# Altium project SAMW25_Xplained_Pro.PrjPCB (part 2 of 2)

## Sheet SAMW25_Xplained_Pro_triple_input_power_supply.SchDoc: Power supply
size A3; Organization: ATMEL Norway; Address1: Vestre Rosten 79; Address2: N-7075 TILLER; Address3: NORWAY; DocumentNumber: A09-2449; Revision: 1; SheetNumber: 2; SheetTotal: 5; PageSetup: Record=PageOptions|CenterHorizontal=True|CenterVertical=True|PrintScale=1.01|XCorrection=1.00|YCorrection=1.00|PrintKind=1|BorderSize=5000000|LeftOffset=0|BottomOffset=0|Orientation=2|PaperLength=1000|PaperWidth=1000|Scale=100|PaperSource=7|PrintQuality=-4|MediaType=1|DitherType=10|PaperKind=A3 (297 x 420 mm)|PrintScaleMode=1
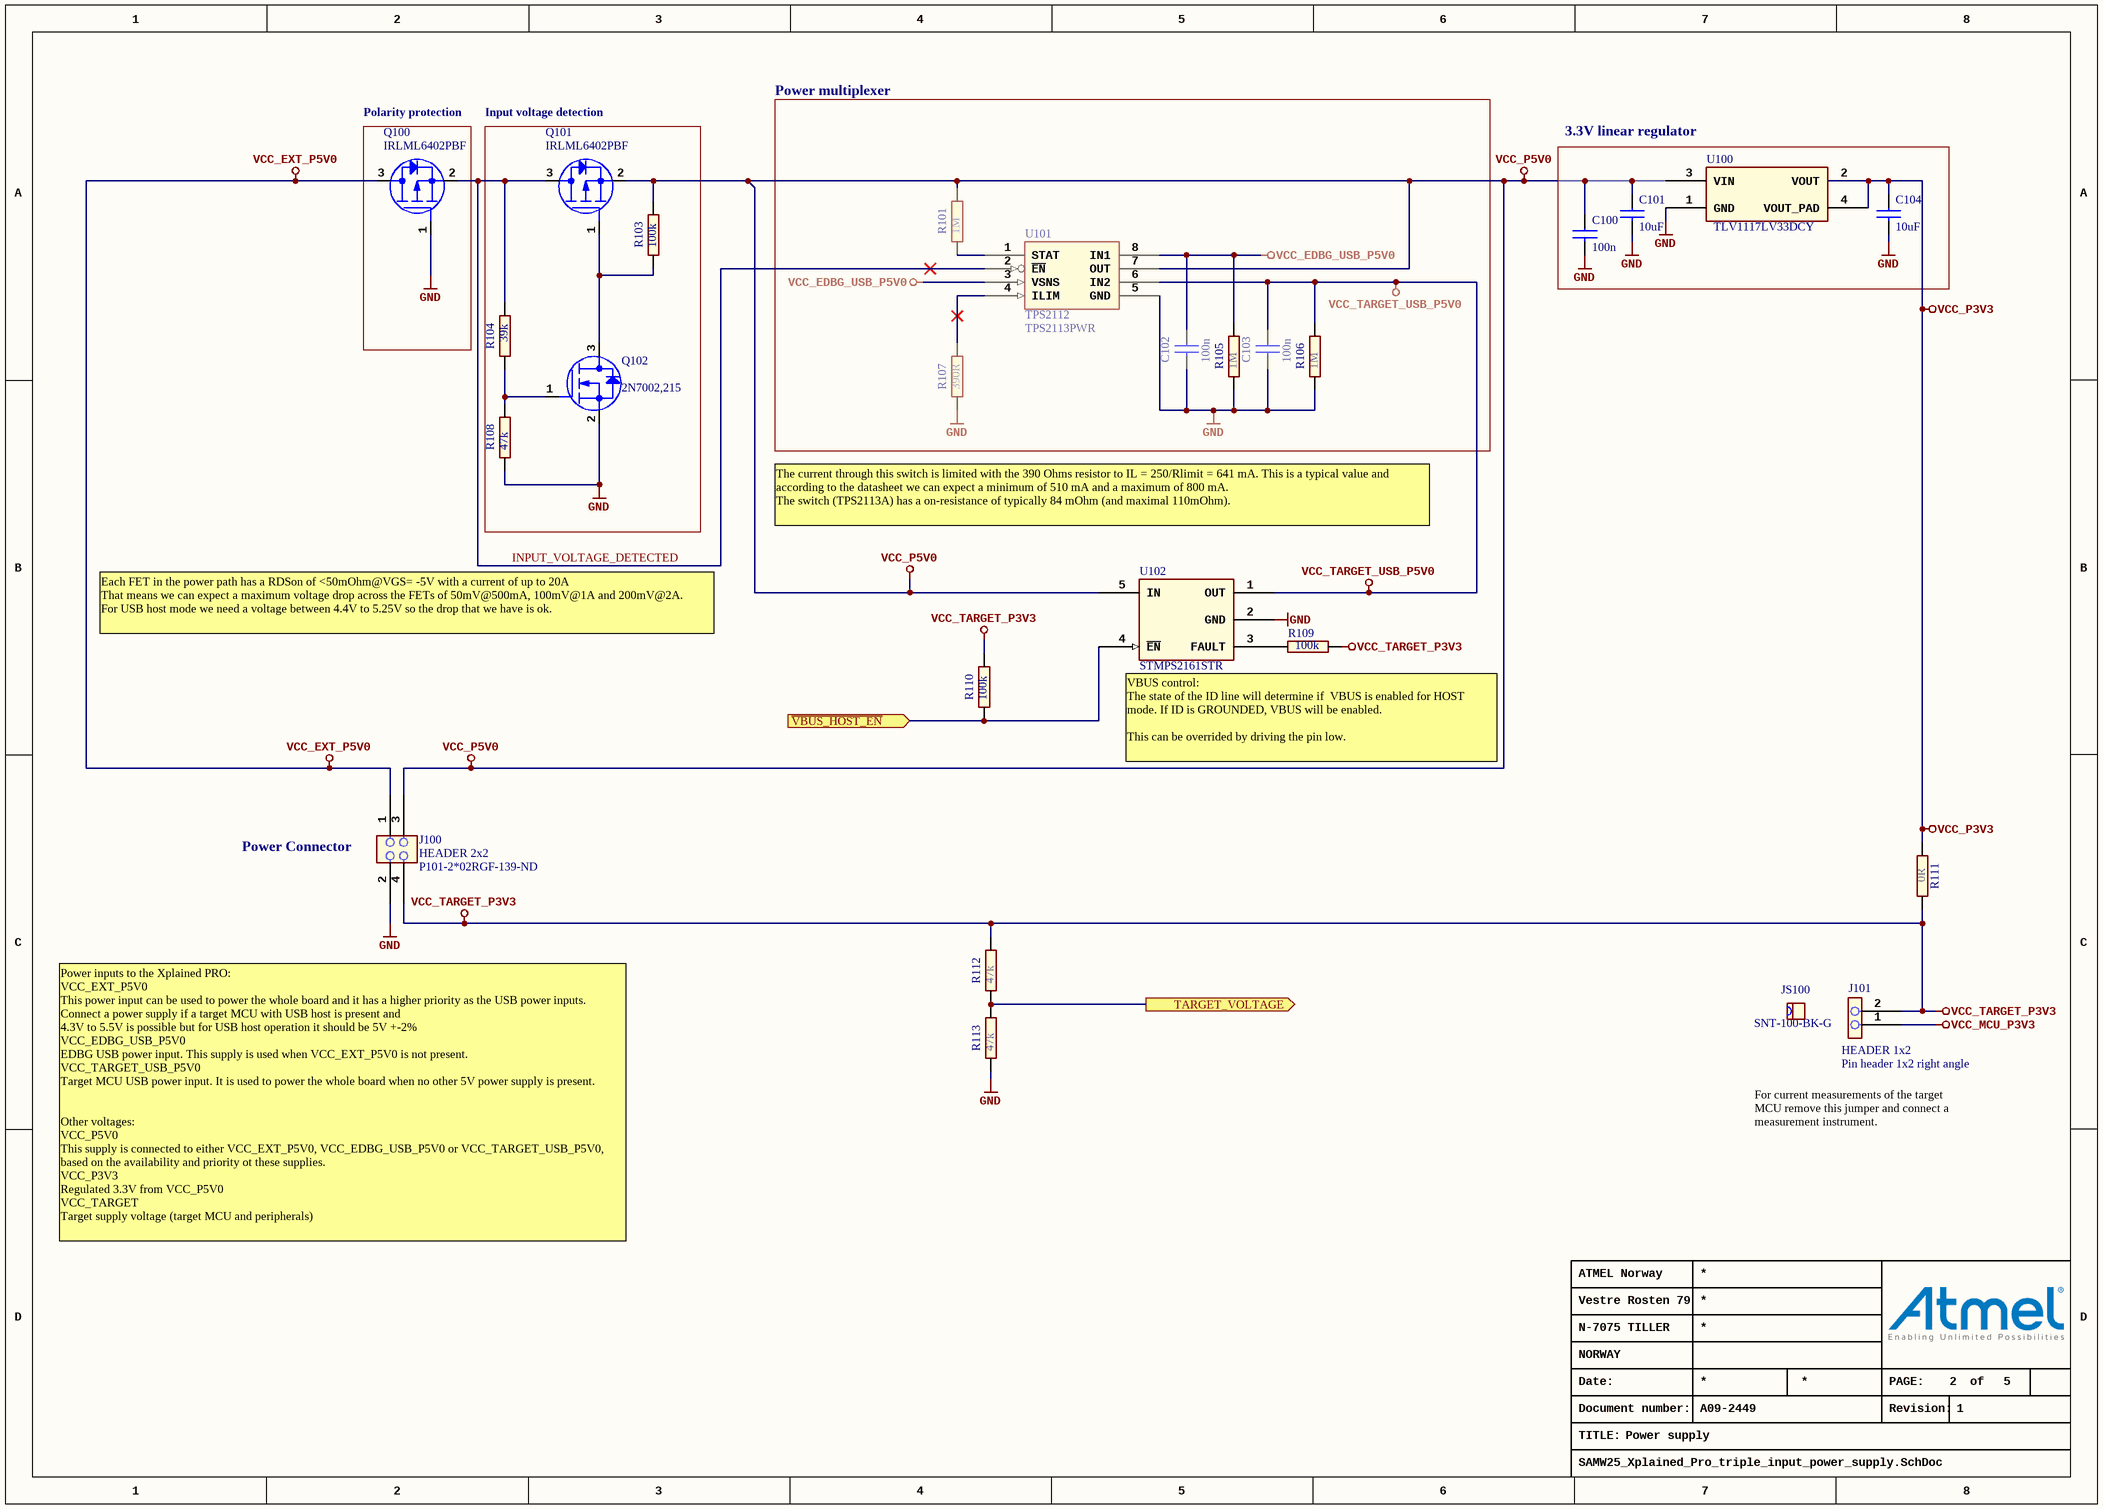
[diagram p4: SAMW25_Xplained_Pro_triple_input_power_supply.SchDoc]

### Parts
C100  value 100n  [AP1-00001]  (hidden comment: CAP-NONPOL)
C101  value 10uF  [AP1-00039]  (hidden comment: CAP-NONPOL)
C102  value 100n  [AP1-00053]  (hidden comment: CAP-NONPOL)
C103  value 100n  [AP1-00053]  (hidden comment: CAP-NONPOL)
C104  value 10uF  [AP1-00039]  (hidden comment: CAP-NONPOL)
J100  HEADER 2x2  value P101-2*02RGF-139-ND  [AP8-00628]
J101  HEADER 1x2  value Pin header 1x2 right angle  [AP8-00367]
JS100  value SNT-100-BK-G  [AP8-00525]  (hidden comment: To be used by request from ESCATEC)
Q100  value IRLML6402PBF  [AP5-00002]  (hidden comment: MOSFET_P_GSD)
Q101  value IRLML6402PBF  [AP5-00002]  (hidden comment: MOSFET_P_GSD)
Q102  value 2N7002,215  [AP5-00002]  (hidden comment: MOSFET_N_GSD)
R101  value 1M  [AP2-00011]  (hidden comment: R2)
R103  value 100k  [AP2-00011]  (hidden comment: R2)
R104  value 39k  [AP2-00011]  (hidden comment: R2)
R105  value 1M  [AP2-00011]  (hidden comment: R2)
R106  value 1M  [AP2-00011]  (hidden comment: R2)
R107  value 390R  [AP2-00011]  (hidden comment: R2)
R108  value 47k  [AP2-00011]  (hidden comment: R2)
R109  value 100k  [AP2-00011]  (hidden comment: R2)
R110  value 100k  [AP2-00011]  (hidden comment: R2)
R111  value 0R  [AP2-00011]  (hidden comment: R2)
R112  value 47k  [AP2-00011]  (hidden comment: R2)
R113  value 47k  [AP2-00011]  (hidden comment: R2)
U100  value TLV1117LV33DCY  [AP6-00399]  (hidden comment: VOLTREG_SOT223_4)
U101  TPS2112  value TPS2113PWR  [AP6-00054]
U102  value STMPS2161STR  [AP6-00087]  (hidden comment: STMPS2161)

### Blocks framed on the sheet
Polarity protection: Q100
Input voltage detection: Q101 Q102 R103 R104 R108
Power multiplexer: C102 C103 R101 R105-R107 U101
3.3V linear regulator: C100 C101 C104 U100

### Ports
TARGET_VOLTAGE (out), ~{VBUS_HOST_EN} (in)

### Nets
GND: C100.2 C101.2 C102.2 C103.2 C104.2 J100.2 Q100.1(G) Q102.2(S) R105.1 R106.1 R107.1 R108.1 R113.1 U100.1(GND) U101.5(GND) U102.2(GND)
VCC_EDBG_USB_P5V0: C102.1 R105.2 U101.3(VSNS) U101.8(IN1)
VCC_EXT_P5V0: J100.1 Q100.3(D)
VCC_MCU_P3V3: J101.1
VCC_P3V3: C104.1 R111.1 U100.2(VOUT) U100.4(VOUT_PAD)
VCC_P5V0: C100.1 C101.1 J100.3 Q101.2(S) R101.2 R103.2 U100.3(VIN) U101.7(OUT) U102.5(IN)
VCC_TARGET_P3V3: J100.4 J101.2 R109.1 R110.2 R111.2 R112.2
VCC_TARGET_USB_P5V0: C103.1 R106.2 U101.6(IN2) U102.1(OUT)
EDBG_ADC0: R112.1 R113.2 ; port TARGET_VOLTAGE
INPUT_VOLTAGE_DETECTED: Q100.2(S) Q101.3(D) R104.2 U101.2(~{EN})
TARGET_USB_ID: R110.1 U102.4(~{EN}) ; port ~{VBUS_HOST_EN}
NetQ101_1: Q101.1(G) Q102.3(D) R103.1
NetQ102_1: Q102.1(G) R104.1 R108.2
NetR101_1: R101.1 U101.1(STAT)
NetR107_2: R107.2 U101.4(ILIM)
NetR109_2: R109.2 U102.3(FAULT)

### Notes on the sheet
- The current through this switch is limited with the 390 Ohms resistor to IL = 250/Rlimit = 641 mA. This is a typical value and according to the datasheet we can expect a minimum of 510 mA and a maximum of 800 mA.
  The switch (TPS2113A) has a on-resistance of typically 84 mOhm (and maximal 110mOhm).
- Each FET in the power path has a RDSon of <50mOhm@VGS= -5V with a current of up to 20A
  That means we can expect a maximum voltage drop across the FETs of 50mV@500mA, 100mV@1A and 200mV@2A.
  For USB host mode we need a voltage between 4.4V to 5.25V so the drop that we have is ok.
- VBUS control:
  The state of the ID line will determine if  VBUS is enabled for HOST mode. If ID is GROUNDED, VBUS will be enabled.
  This can be overrided by driving the pin low.
- (near J100) Power Connector
- For current measurements of the target MCU remove this jumper and connect a measurement instrument.
- Power inputs to the Xplained PRO:
  VCC_EXT_P5V0
  This power input can be used to power the whole board and it has a higher priority as the USB power inputs. Connect a power supply if a target MCU with USB host is present and
  4.3V to 5.5V is possible but for USB host operation it should be 5V +-2%
  VCC_EDBG_USB_P5V0
  EDBG USB power input. This supply is used when VCC_EXT_P5V0 is not present.
  VCC_TARGET_USB_P5V0
  Target MCU USB power input. It is used to power the whole board when no other 5V power supply is present.
  Other voltages:
  VCC_P5V0
  This supply is connected to either VCC_EXT_P5V0, VCC_EDBG_USB_P5V0 or VCC_TARGET_USB_P5V0, based on the availability and priority ot these supplies.
  VCC_P3V3
  Regulated 3.3V from VCC_P5V0
  VCC_TARGET
  Target supply voltage (target MCU and peripherals)
- Date:
- PAGE:
- of
- TITLE:
- Document number:
- Revision:

### Library data of the parts
C100 C102 C103 = A01-0246: Ceramic capacitor, SMD 0402, X7R, 16V, +/-10%; PartGroup: Capacitors,Ceramic,SMD 0402; Manufacturer: Kemet; MPN: C0402C104K4RACTU; TemperatureRange: -55 - +125 deg C; ComponentStatus: 'Active (verified)'; Status: Active; Verified by: Lars Helge Mo; Verified date: 2005-12-15; AN: A01-0246; Tolerance: 16V, +/-10%; Height: 0.5; FootprintStatus: 'Active (Verified)'
C101 C104 = A01-0491: Ceramic capacitor, SMD 0603, X5R, 16V, 10UF ± 20% (High Density); PartGroup: Capacitors,Ceramic,SMD 0603; Manufacturer: Taiyo Yuden; MPN: EMK107BBJ106MA-T; Tolerance: ­± 20%; TemperatureRange: -55°C to +85°C; ComponentStatus: 'Active (verified)'; Status: Active; Verified by: Lars Helge Mo; Verified date: 2005-12-15; AN: A01-0491; Height: 0.819999992847443; FootprintStatus: 'Active (Verified)'
J100 = A08-1519: Pin header, 2x2, Right Angle, 2.54mm, THT, Pin In Paste; PartGroup: Mechanical devices,Connectors,Pin headers; Manufacturer: Pro-data International Corp; ComponentStatus: 'Active (verified)'; Verified date: 2005-12-19; Verified by: Lars Helge Mo; Status: Active; AN: A08-1519; Height: 5.07999992370605; MPN: P101-2*02RGF-139-ND; FootprintStatus: 'Active (Verified)'
J101 = A08-0764: 1x2 pin header, right angle, 2.54 mm pitch, through-hole; PartGroup: Mechanical devices,Connectors,Pin headers; Manufacturer: Pro-data International Corp; MPN: 2213R-2G; ComponentStatus: 'Active (verified)'; Verified date: 2006-01-30; Verified by: Lars Helge; Status: Active; AN: A08-0764; Height: 2.53999996185303; FootprintStatus: 'Active (Verified)'
JS100 = A08-0543: Jumper cap for 2.54mm pinheader; PartGroup: Mechanical devices,Mounting accessories,Other; Manufacturer: SAMTEC; ComponentStatus: 'Active (verified)'; Verified date: 2006-04-05; Verified by: Lars Helge Mo; Status: Active; AN: A08-0543; MPN: SNT-100-BK-G; FootprintStatus: 'Active (Verified)'
Q100 Q101 = A05-0087: P-ch. MOSFET. -30V, -3.7A continuous,RDS(ON)=0.05Ohm@VGS=-4,5V, RDS(ON)=0.08Ohm@VGS=-2.5V; PartGroup: Transistors,Power FET,SMD; Manufacturer: International Rectifier; TemperatureRange: -55 - +150 deg C; ComponentStatus: 'Active (verified)'; Status: New; AN: A05-0087; Height: 1.14999997615814; MPN: IRLML6402PBF; FootprintStatus: 'Active (Verified)'
Q102 = A05-0085: N-Channel MOSFET. 60V, 0.300A continuous, 1.2A Peak. RDS(ON) = 3.8Ohm@VGS=4.5V, VGS(th)<2.5V; PartGroup: Transistors,Small signal FET,SMD; Manufacturer: NXP; TemperatureRange: -65 to 150 deg C; ComponentStatus: 'Active (verified)'; Status: New; AN: A05-0085; Height: 1.10000002384186; MPN: 2N7002,215; FootprintStatus: 'Active (Verified)'
R101 R105 R106 = A02-0284: Thick film resistor, SMD 0402, 1/16W, 1%; PartGroup: Resistors,SMD,0402 1%; TemperatureRange: -55 - +125 deg C; ComponentStatus: 'Active (verified)'; Status: Active; Verified by: Lars Helge Mo; Verified date: 2005-12-19; AN: A02-0284; Tolerance: 1 %; Height: 0.349999994039536; FootprintStatus: 'Active (Verified)'
R103 R109 R110 = A02-0260: Thick film resistor, SMD 0402, 1/16W, 1%; PartGroup: Resistors,SMD,0402 1%; TemperatureRange: -55 - +125 deg C; ComponentStatus: 'Active (verified)'; Status: Active; Verified by: Lars Helge Mo; Verified date: 2005-12-19; AN: A02-0260; Tolerance: 1 %; Height: 0.349999994039536; FootprintStatus: 'Active (Verified)'
R104 = A02-0250: Thick film resistor, SMD 0402, 1/16W, 1%; PartGroup: Resistors,SMD,0402 1%; TemperatureRange: -55 - +125 deg C; ComponentStatus: 'Active (verified)'; Status: Active; Verified by: Lars Helge Mo; Verified date: 2005-12-19; AN: A02-0250; Tolerance: 1 %; Height: 0.349999994039536; FootprintStatus: 'Active (Verified)'
R107 = A02-0202: Thick film resistor, SMD 0402, 1/16W, 1%; PartGroup: Resistors,SMD,0402 1%; TemperatureRange: -55 - +125 deg C; ComponentStatus: 'Active (verified)'; Status: Active; Verified by: Lars Helge Mo; Verified date: 2005-12-19; AN: A02-0202; Tolerance: 1 %; Height: 0.349999994039536; FootprintStatus: 'Active (Verified)'
R108 R112 R113 = A02-0252: Thick film resistor, SMD 0402, 1/16W, 1%; PartGroup: Resistors,SMD,0402 1%; TemperatureRange: -55 - +125 deg C; ComponentStatus: 'Active (verified)'; Status: Active; Verified by: Lars Helge Mo; Verified date: 2005-12-19; AN: A02-0252; Tolerance: 1 %; Height: 0.349999994039536; FootprintStatus: 'Active (Verified)'
R111 = A02-0163: Thick film resistor, SMD 0402, 1/16W, 1%; PartGroup: Resistors,SMD,0402 1%; TemperatureRange: -55 - +125 deg C; ComponentStatus: 'Active (verified)'; Status: Active; Verified by: Lars Helge Mo; Verified date: 2005-12-19; AN: A02-0163; Tolerance: 1 %; Height: 0.349999994039536; FootprintStatus: 'Active (Verified)'
U100 = A06-1145: 1-A, LDO (0.455V @ 1A), 3.3V out, 1.5% accuracy, 6.0V Vin max.; PartGroup: Integrated Circuits,Regulators,Linear; Manufacturer: Texas Instruments; MPN: TLV1117LV33DCYR; TemperatureRange: -40Â°C to 125Â°C; ComponentStatus: 'Active (verified)'; Status: New; Verified date: 04.08.2008; AN: A06-1145; Height: 1.79999995231628; FootprintStatus: 'Active (Verified)'
U101 = A06-0068: Autoswitching 2:1 Power Mux; PartGroup: Integrated Circuits,General linear,Analog switch, bus switch and MUX; Manufacturer: Texas Instruments; TemperatureRange: -40 - + 125 deg C; ComponentStatus: 'Active (verified)'; Verified date: 2006-02-16; Verified by: Sveinung Helgeland; Status: Active; AN: A06-0068; Height: 1.20000004768372; MPN: TPS2113PWR; FootprintStatus: 'Active (Verified)'
U102 = A06-1087: Single channel power switch, 1A, reverse block, active low enabled.; PartGroup: Integrated Circuits,General linear,Analog switch, bus switch and MUX; Tolerance: 2.7 to 5.5V; TemperatureRange: -40Â°C to +85Â°C; ComponentStatus: 'Active (verified)'; Verified date: *; Verified by: *; Status: *; Design comment: *; AN: A06-1087; Height: 1.45000004768372; FootprintStatus: 'Active (Verified)'

## Nets that join several sheets
GND: SAMW25_Xplained_Pro_WIFI_module (26 pins), SAMW25_Xplained_Pro_EDBG (33 pins), SAMW25_Xplained_Pro_Connectors (10 pins), SAMW25_Xplained_Pro_triple_input_power_supply (16 pins)
VCC_EDBG_USB_P5V0: SAMW25_Xplained_Pro_EDBG (C408.1 L401.2 U400.A10), SAMW25_Xplained_Pro_triple_input_power_supply (C102.1 R105.2 U101.3 U101.8)
VCC_MCU_P3V3: SAMW25_Xplained_Pro_WIFI_module (C301.1 C302.1 U300.7 U300.21), SAMW25_Xplained_Pro_triple_input_power_supply (J101.1)
VCC_P3V3: SAMW25_Xplained_Pro_EDBG (R425.2), SAMW25_Xplained_Pro_triple_input_power_supply (C104.1 R111.1 U100.2 U100.4)
VCC_TARGET_P3V3: SAMW25_Xplained_Pro_WIFI_module (13 pins), SAMW25_Xplained_Pro_Connectors (J200.20 J203.1), SAMW25_Xplained_Pro_triple_input_power_supply (6 pins)
VCC_TARGET_USB_P5V0: SAMW25_Xplained_Pro_Connectors (D200.4 J201.1 R201.2), SAMW25_Xplained_Pro_triple_input_power_supply (C103.1 R106.2 U101.6 U102.1)
EDBG_ADC0: SAMW25_Xplained_Pro_EDBG (U400.K10), SAMW25_Xplained_Pro_triple_input_power_supply (R112.1 R113.2)
EDBG_CDC_USART_RX: SAMW25_Xplained_Pro_WIFI_module (U300.43), SAMW25_Xplained_Pro_EDBG (U400.F9), SAMW25_Xplained_Pro_Connectors (J200.14)
EDBG_DGI_SCL: SAMW25_Xplained_Pro_WIFI_module (R300.2 U300.39), SAMW25_Xplained_Pro_EDBG (U400.F7), SAMW25_Xplained_Pro_Connectors (J200.12)
EDBG_DGI_SDA: SAMW25_Xplained_Pro_WIFI_module (R301.2 U300.38), SAMW25_Xplained_Pro_EDBG (U400.G7), SAMW25_Xplained_Pro_Connectors (J200.11)
EDBG_SPI_DGI_MOSI: SAMW25_Xplained_Pro_WIFI_module (R317.2 U300.11), SAMW25_Xplained_Pro_EDBG (U400.K3), SAMW25_Xplained_Pro_Connectors (J200.16)
EDBG_SPI_DGI_SCK: SAMW25_Xplained_Pro_WIFI_module (R316.2 U300.12), SAMW25_Xplained_Pro_EDBG (U400.J4), SAMW25_Xplained_Pro_Connectors (J200.18)
EDBG_SPI_DGI_SS: SAMW25_Xplained_Pro_WIFI_module (U300.36), SAMW25_Xplained_Pro_EDBG (U400.G5)
ID1: SAMW25_Xplained_Pro_EDBG (R409.1 U400.A1), SAMW25_Xplained_Pro_Connectors (J200.1)
PA02_ADC0: SAMW25_Xplained_Pro_WIFI_module (U300.31), SAMW25_Xplained_Pro_Connectors (J200.3)
PA03_ADC1: SAMW25_Xplained_Pro_WIFI_module (U300.33), SAMW25_Xplained_Pro_Connectors (J200.4)
PA04_ADC4: SAMW25_Xplained_Pro_WIFI_module (U300.34), SAMW25_Xplained_Pro_Connectors (R200.2)
PA05_ADC5: SAMW25_Xplained_Pro_WIFI_module (U300.35), SAMW25_Xplained_Pro_Connectors (R202.2)
PA10_PWM_TC0_2: SAMW25_Xplained_Pro_WIFI_module (U300.40), SAMW25_Xplained_Pro_Connectors (J200.7)
PA11_PWM_TC0_3: SAMW25_Xplained_Pro_WIFI_module (U300.41), SAMW25_Xplained_Pro_Connectors (J200.8)
PA16_S1_SPI_MISO: SAMW25_Xplained_Pro_WIFI_module (R318.2 U300.8), SAMW25_Xplained_Pro_EDBG (R420.2), SAMW25_Xplained_Pro_Connectors (J200.17)
PA17_S1_SPI_SS: SAMW25_Xplained_Pro_WIFI_module (U300.9), SAMW25_Xplained_Pro_Connectors (J200.15)
PA20_GPIO_IRQ4: SAMW25_Xplained_Pro_WIFI_module (U300.13), SAMW25_Xplained_Pro_Connectors (J200.9)
PA21_GPIO_SS: SAMW25_Xplained_Pro_WIFI_module (U300.14), SAMW25_Xplained_Pro_Connectors (J200.10)
PA22_TC4_0: SAMW25_Xplained_Pro_WIFI_module (R324.1 U300.15), SAMW25_Xplained_Pro_EDBG (R418.1)
PA23_PWM_TC4_1: SAMW25_Xplained_Pro_WIFI_module (D301.1 U300.16), SAMW25_Xplained_Pro_EDBG (R419.1)
PB02_GPIO1: SAMW25_Xplained_Pro_WIFI_module (U300.27), SAMW25_Xplained_Pro_Connectors (J200.5)
PB03_GPIO2: SAMW25_Xplained_Pro_WIFI_module (U300.28), SAMW25_Xplained_Pro_Connectors (J200.6)
PB11_S4_UART_RX: SAMW25_Xplained_Pro_WIFI_module (U300.44), SAMW25_Xplained_Pro_EDBG (R414.1), SAMW25_Xplained_Pro_Connectors (J200.13)
PB22_GPIO1: SAMW25_Xplained_Pro_WIFI_module (U300.22), SAMW25_Xplained_Pro_EDBG (R416.1)
PB23_GPIO2: SAMW25_Xplained_Pro_WIFI_module (R309.2 U300.23), SAMW25_Xplained_Pro_EDBG (R417.1)
SWCLK: SAMW25_Xplained_Pro_WIFI_module (R314.1), SAMW25_Xplained_Pro_EDBG (U400.D6), SAMW25_Xplained_Pro_Connectors (J203.4)
SWDIO: SAMW25_Xplained_Pro_WIFI_module (R315.1), SAMW25_Xplained_Pro_EDBG (U400.C5), SAMW25_Xplained_Pro_Connectors (J203.2)
TARGET_RESET: SAMW25_Xplained_Pro_WIFI_module (R311.1), SAMW25_Xplained_Pro_EDBG (U400.B4), SAMW25_Xplained_Pro_Connectors (J203.10)
TARGET_RESET_SENSE: SAMW25_Xplained_Pro_WIFI_module (5 pins), SAMW25_Xplained_Pro_EDBG (U400.H2)
TARGET_USB_ID: SAMW25_Xplained_Pro_Connectors (J201.4 R200.1), SAMW25_Xplained_Pro_triple_input_power_supply (R110.1 U102.4)
TARGET_USB_N: SAMW25_Xplained_Pro_WIFI_module (U300.18), SAMW25_Xplained_Pro_Connectors (D200.3 J201.2)
TARGET_USB_P: SAMW25_Xplained_Pro_WIFI_module (U300.19), SAMW25_Xplained_Pro_Connectors (D200.2 J201.3)

## Assembly variants
Default_assembly: not fitted C200 C300 C403 J300 J301 R204 R302 R303 R308 R418 R424 SW300